# Altium schematic sheet Synchronizer.SchDoc
size A4; SheetNumber: 2; SheetTotal: 2
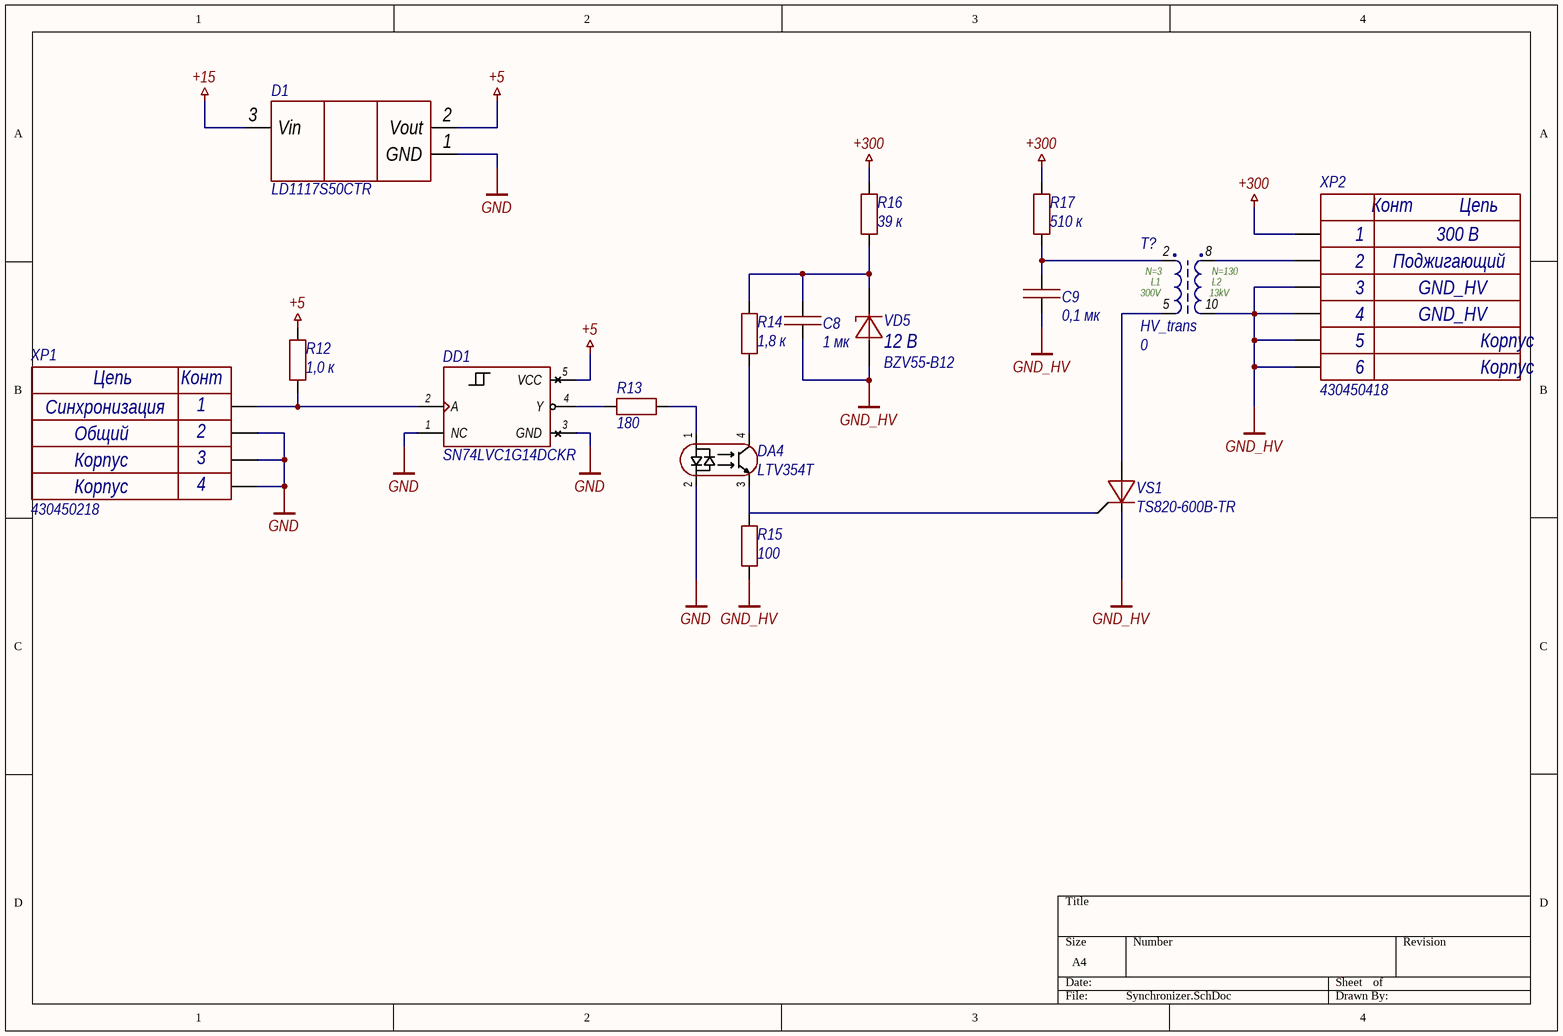
[diagram p0: Synchronizer.SchDoc]

## Parts
C8  value 1 мк  [0603C]  (hidden comment: Capacitor)
C9  value 0,1 мк  [1812C]  (hidden comment: Capacitor)
D1  LD1117S50CTR  [SOT223]
DA4  LTV354T  [SOP4-2_54]
DD1  SN74LVC1G14DCKR  [SC-70-5]
R12  value 1,0 к  [0603R]  (hidden comment: Resistor)
R13  value 180  [0603R]  (hidden comment: Resistor)
R14  value 1,8 к  [0603R]  (hidden comment: Resistor)
R15  value 100  [0603R]  (hidden comment: Resistor)
R16  value 39 к  [0603R]  (hidden comment: Resistor)
R17  value 510 к  [0603R]  (hidden comment: Resistor)
T?  HV_trans  value 0  [EE16_transformer]
VD5  BZV55-B12  value 12 В  [mini_MELF_3.5mm]
VS1  TS820-600B-TR  [DPAK]
XP1  430450218  Value3: Корпус  Value2: Общий  Value1: Синхронизация  [Molex_430450218]
XP2  430450418  Value1: 300 В  Value2: Поджигающий  Value3: GND_HV  [MOLEX_430450418]

## Nets
+5: D1.2(Vout) DD1.5(VCC) R12.2
+15: D1.3(Vin)
+300: R16.2 R17.2 XP2.1
GND: D1.1(GND) DA4.2(C) DD1.1(NC) DD1.3(GND) XP1.0 XP1.2
GND_HV: C8.1 C9.1 R15.1 T?.10 VD5.1 VS1.1 XP2.0 XP2.3 XP2.4
NetC8_2: C8.2 R14.2 R16.1 VD5.2
NetC9_2: C9.2 R17.1 T?.2
NetDA4_1: DA4.1(A) R13.2
NetDA4_3: DA4.3(ET) R15.2 VS1.3
NetDA4_4: DA4.4(CT) R14.1
NetDD1_2: DD1.2(A) R12.1 XP1.1
NetDD1_4: DD1.4(Y) R13.1
NetT?_5: T?.5 VS1.2
NetT?_8: T?.8 XP2.2

## Notes on the sheet
- (in symbol HV_trans) N=3; N=130; L1; L2; 300V; 13kV
- (in symbol Molex_430450218) Цепь; Конт; 3; 4
- (in symbol Molex_430450418) Конт; Цепь; 5; Корпус; 6

## Library data of the parts
C8 = Capacitor_1u_10_50V_X7R_0603C: Конденсатор; Library Path2: Schematic\Capacitor.SchLib; Tolerance: 0,1; Voltage (V): 50; Dielectric: X7R; Capacity (nF): 1000; Part Number: Capacitor_1u_10_50V_X7R_0603C
C9 = Capacitor_0,1u_10_1000V_X7R_1812C: Конденсатор; Library Path2: Schematic\Capacitor.SchLib; Tolerance: 0,1; Voltage (V): 1000; Dielectric: X7R; Capacity (nF): 100; Part Number: Capacitor_0,1u_10_1000V_X7R_1812C
D1 = LD1117S50CTR: Линейный стабилизатор напряжения; Part Number: LD1117S50CTR
DA4 = LTV354T: Оптопара с транзисторным выходом, UMW; SnapEDA_Link: https://www.snapeda.com/parts/LTV816/Lite-On/view-part/?ref=snap; Check_prices: https://www.snapeda.com/parts/LTV816/Lite-On/view-part/?ref=eda; Value: *; Part Number: LTV354T
DD1 = SN74LVC1G14DCKR: Одноканальный инвертор с триггером Шмитта; Part Number: SN74LVC1G14DCKR
R12 = Resistor_1.0k_1_0603: Резистор номиналом 1,0 кОм и точностью 1%; Power: *; Part Number: Resistor_1.0k_1_0603; Tolerance: 1%
R13 = Resistor_180_1_0603: Резистор номиналом 180 Ом и точностью 1%; Power: *; Part Number: Resistor_180_1_0603; Tolerance: 1%
R14 = Resistor_1.8k_1_0603: Резистор номиналом 1,8 кОм и точностью 1%; Power: *; Part Number: Resistor_1.8k_1_0603; Tolerance: 1%
R15 = Resistor_100_1_0603: Резистор номиналом 100 Ом и точностью 1%; Power: *; Part Number: Resistor_100_1_0603; Tolerance: 1%
R16 = Resistor_39k_1_0603: Резистор номиналом 39 кОм и точностью 1%; Power: *; Part Number: Resistor_39k_1_0603; Tolerance: 1%
R17 = Resistor_510k_1_0603: Резистор номиналом 510 кОм и точностью 1%; Power: *; Part Number: Resistor_510k_1_0603; Tolerance: 1%
T? = HV_trans: Импульсный трансформатор для поджига вспышки; Current (A): 10000; Part Number: HV_trans
VD5 = BZV55-B12: Стабилитрон 12В, 5%, 0.5Вт; Voltage nominal (V): 12; Current nominal (mA): 5; Power (W): 0.5; Accuracy: 0,02; Part Number: BZV55-B12
VS1 = TS820-600B-TR: Тиристор 600В 8А; Part Number: TS820-600B-TR; Напряжение: 600 В; Ток макс#: 8 А
XP1 = Molex_430450218: Разъем типа провод-плата, 3 мм, 2 контакт(-ов), Штыревой Разъем, Серия Micro-Fit для поверхностного монтажа; Value4: Корпус; Part Number: Molex_430450218
XP2 = Molex_430450418: Разъем типа провод-плата, 3 мм, 4 контакт(-ов), Штыревой Разъем, для поверностного монтажа; Value4: GND_HV; Part Number: Molex_430450418